# EAGLE design tiny2313_stepper_2 (EAGLE 5.06)
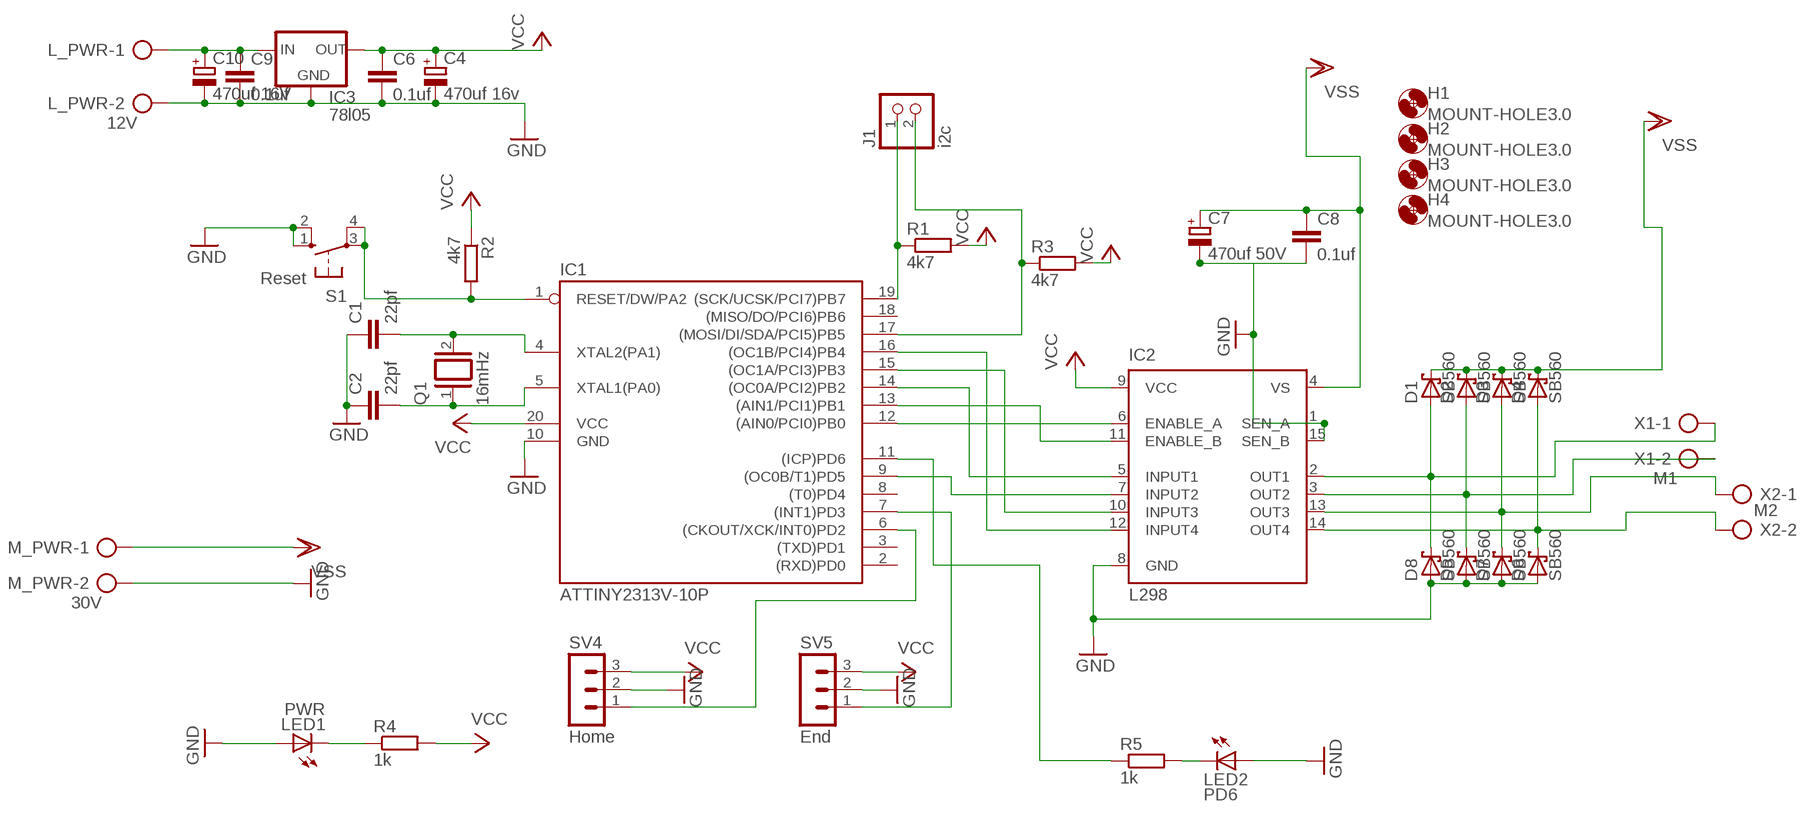
[diagram p0: schematic, sheet 1]

## Parts
C1  22pf  C-EU025-024X044  [C025-024X044]
C2  22pf  C-EU025-024X044  [C025-024X044]
C4  470uf 16v  CPOL-EUE3.5-8  [E3,5-8]
C6  0.1uf  C-EU025-025X050  [C025-025X050]
C7  470uf 50V  CPOL-EUE3.5-8  [E3,5-8]
C8  0.1uf  C-EU025-025X050  [C025-025X050]
C9  0.1uf  C-EU025-025X050  [C025-025X050]
C10  470uf 16V  CPOL-EUE3.5-8  [E3,5-8]
D1  SB560  SCHOTTKY-DIODEF126Z12  [F126Z12]
D2  SB560  SCHOTTKY-DIODEF126Z12  [F126Z12]
D3  SB560  SCHOTTKY-DIODEF126Z12  [F126Z12]
D4  SB560  SCHOTTKY-DIODEF126Z12  [F126Z12]
D5  SB560  SCHOTTKY-DIODEF126Z12  [F126Z12]
D6  SB560  SCHOTTKY-DIODEF126Z12  [F126Z12]
D7  SB560  SCHOTTKY-DIODEF126Z12  [F126Z12]
D8  SB560  SCHOTTKY-DIODEF126Z12  [F126Z12]
H1  MOUNT-HOLE3.0  [3,0]
H2  MOUNT-HOLE3.0  [3,0]
H3  MOUNT-HOLE3.0  [3,0]
H4  MOUNT-HOLE3.0  [3,0]
IC1  ATTINY2313V-10P  [DIL20]
IC2  L298  [MULTIWATT-15]
IC3  78l05  78XXS  [78XXS]
J1  i2c  PINHD-1X2  [1X02]
L_PWR  12V  AK500/2  [AK500/2]
LED1  PWR  LED5MM  [LED5MM]
LED2  PD6  LED5MM  [LED5MM]
M_PWR  30V  AK500/2  [AK500/2]
Q1  16mHz  XTAL/S  [QS]
R1  4k7  R-EU_0204/7  [0204/7]
R2  4k7  R-EU_0204/7  [0204/7]
R3  4k7  R-EU_0204/7  [0204/7]
R4  1k  R-EU_0204/7  [0204/7]
R5  1k  R-EU_0204/7  [0204/7]
S1  Reset  10-XX  [B3F-10XX]
SV4  Home  MA03-1  [MA03-1]
SV5  End  MA03-1  [MA03-1]
X1  M1  AK500/2  [AK500/2]
X2  M2  AK500/2  [AK500/2]

## Nets
GND: C1.1 C2.1 C4.- C6.2 C7.- C8.2 C9.2 C10.- D5.A D6.A D7.A D8.A IC1.10(GND) IC2.1(SEN_A) IC2.8(GND) IC2.15(SEN_B) IC3.GND L_PWR.2 LED1.A LED2.A M_PWR.2 S1.1(S) S1.2(S1) SV4.2 SV5.2
N$1: C1.2 IC1.4(XTAL2(PA1)) Q1.2
N$2: C2.2 IC1.5(XTAL1(PA0)) Q1.1
N$3: IC1.1(RESET/DW/PA2) R2.2 S1.3(P) S1.4(P1)
N$4: IC1.19((SCK/UCSK/PCI7)PB7) J1.1 R1.1
N$5: IC1.17((MOSI/DI/SDA/PCI5)PB5) J1.2 R3.1
N$6: IC1.6((CKOUT/XCK/INT0)PD2) SV4.1
N$7: IC1.12((AIN0/PCI0)PB0) IC2.6(ENABLE_A)
N$8: IC1.13((AIN1/PCI1)PB1) IC2.11(ENABLE_B)
N$9: IC1.14((OC0A/PCI2)PB2) IC2.5(INPUT1)
N$10: IC1.9((OC0B/T1)PD5) IC2.7(INPUT2)
N$11: IC1.15((OC1A/PCI3)PB3) IC2.10(INPUT3)
N$12: IC1.16((OC1B/PCI4)PB4) IC2.12(INPUT4)
N$13: IC1.7((INT1)PD3) SV5.1
N$14: D1.A D8.C IC2.2(OUT1) X1.1
N$15: D2.A D5.C IC2.3(OUT2) X1.2
N$16: D3.A D7.C IC2.13(OUT3) X2.1
N$17: D4.A D6.C IC2.14(OUT4) X2.2
N$19: LED1.K(C) R4.1
N$20: LED2.K(C) R5.2
N$21: C9.1 C10.+ IC3.IN L_PWR.1
N$22: IC1.11((ICP)PD6) R5.1
VCC: C4.+ C6.1 IC1.20(VCC) IC2.9(VCC) IC3.OUT R1.2 R2.1 R3.2 R4.2 SV4.3 SV5.3
VSS: C7.+ C8.1 D1.C D2.C D3.C D4.C IC2.4(VS) M_PWR.1
Unconnected: IC1.2((RXD)PD0) IC1.3((TXD)PD1) IC1.8((T0)PD4) IC1.18((MISO/DO/PCI6)PB6)

## Library data of the parts
C1 C2 = resistor:C-EU: CAPACITOR, European symbol
C4 C7 C10 = rcl:CPOL-EU: POLARIZED CAPACITOR, European symbol
C6 C8 C9 = rcl:C-EU: CAPACITOR, European symbol
D1-D8 = diode:SCHOTTKY-DIODE: Schottky Diode
H1-H4 = holes:MOUNT-HOLE: MOUNTING HOLE with drill center marker
IC1 = avr:ATTINY2313: MICROCONTROLLER 2 Kbytes FLASH 128 bytes SRAM 128 bytes EEPROM USART USI
IC2 = st-microelectronics:L298: DUAL FULL-BRIDGE DRIVER
IC3 = v-reg:78XXS: VOLTAGE REGULATOR
J1 = pinhead:PINHD-1X2: PIN HEADER
L_PWR M_PWR X1 X2 = con-ptr500:AK500/2: CONNECTOR
LED1 LED2 = led:LED: LED OSRAM: - CHIPLED LG R971, LG N971, LY N971, LG Q971, LY Q971, LO R971, LY R971 LH N974, LH R974 LS Q976, LO Q976, LY Q976 LO Q996 - Hyper CHIPLED LW Q18S LB Q993, LB Q99A, LB R99A - SideLED LS A670, LO A670, LY A670, LG A670, LP A670 LB A673, LV A673, LT A673, LW A673 LH A674 LY A675 LS A676, LA A676, LO A676, LY A676, LW A676 LS A679, LY A679, LG A679 - Hyper Micro SIDELED® LS Y876, LA Y876, LO Y876, LY Y876 LT Y87S - SmartLED LW L88C, LW L88S LB L89C, LB L89S, LG L890 LS L89K, LO L89K, LY L89K LS L896, LA L896, LO L896, LY L896 - TOPLED LS T670, LO T670, LY T670, LG T670, LP T670 LSG T670, LSP T670, LSY T670, LOP T670, LYG T670 LG T671, LOG T671, LSG T671 LB T673, LV T673, LT T673, LW T673 LH T674 LS T676, LA T676, LO T676, LY T676, LB T676, LH T676, LSB T676, LW T676 LB T67C, LV T67C, LT T67C, LS T67K, LO T67K, LY T67K, LW E67C LS E67B, LA E67B, LO E67B, LY E67B, LB E67C, LV E67C, LT E67C LW T67C LS T679, LY T679, LG T679 LS T770, LO T770, LY T770, LG T770, LP T770 LB T773, LV T773, LT T773, LW T773 LH T774 LS E675, LA E675, LY E675, LS T675 LS T776, LA T776, LO T776, LY T776, LB T776 LHGB T686 LT T68C, LB T68C - Hyper Mini TOPLED® LB M676 - Mini TOPLED Santana® LG M470 LS M47K, LO M47K, LY M47K Source: http://www.osram.convergy.de LUXEON: - LUMILED® LXK2-PW12-R00, LXK2-PW12-S00, LXK2-PW14-U00, LXK2-PW14-V00 LXK2-PM12-R00, LXK2-PM12-S00, LXK2-PM14-U00 LXK2-PE12-Q00, LXK2-PE12-R00, LXK2-PE12-S00, LXK2-PE14-T00, LXK2-PE14-U00 LXK2-PB12-K00, LXK2-PB12-L00, LXK2-PB12-M00, LXK2-PB14-N00, LXK2-PB14-P00, LXK2-PB14-Q00 LXK2-PR12-L00, LXK2-PR12-M00, LXK2-PR14-Q00, LXK2-PR14-R00 LXK2-PD12-Q00, LXK2-PD12-R00, LXK2-PD12-S00 LXK2-PH12-R00, LXK2-PH12-S00 LXK2-PL12-P00, LXK2-PL12-Q00, LXK2-PL12-R00 Source: www.luxeon.com KINGBRIGHT: KA-3528ASYC Source: www.kingbright.com
Q1 = special:XTAL/S: CRYSTAL
R1 R3 = resistor:R-EU_: RESISTOR, European symbol
R2 R4 R5 = rcl:R-EU_: RESISTOR, European symbol
S1 = switch-omron:10-XX: OMRON SWITCH
SV4 SV5 = con-lstb:MA03-1: PIN HEADER

## Board
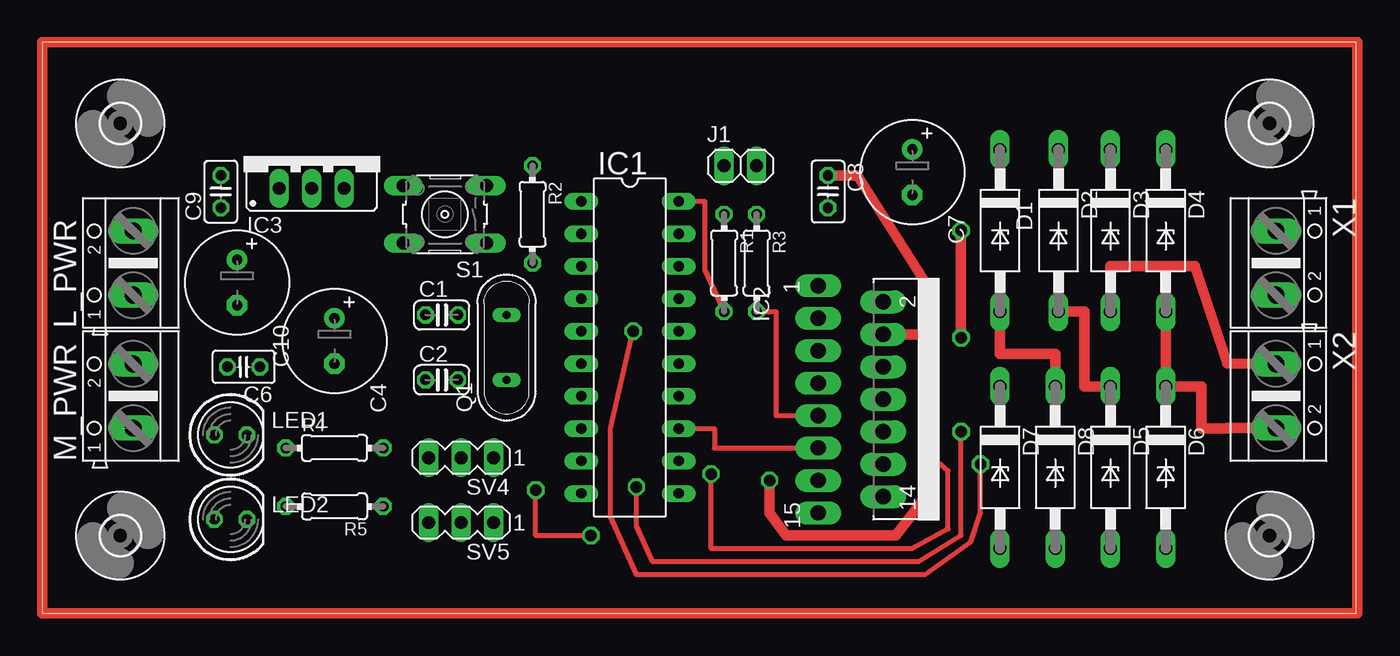
[diagram p1: board, top side]
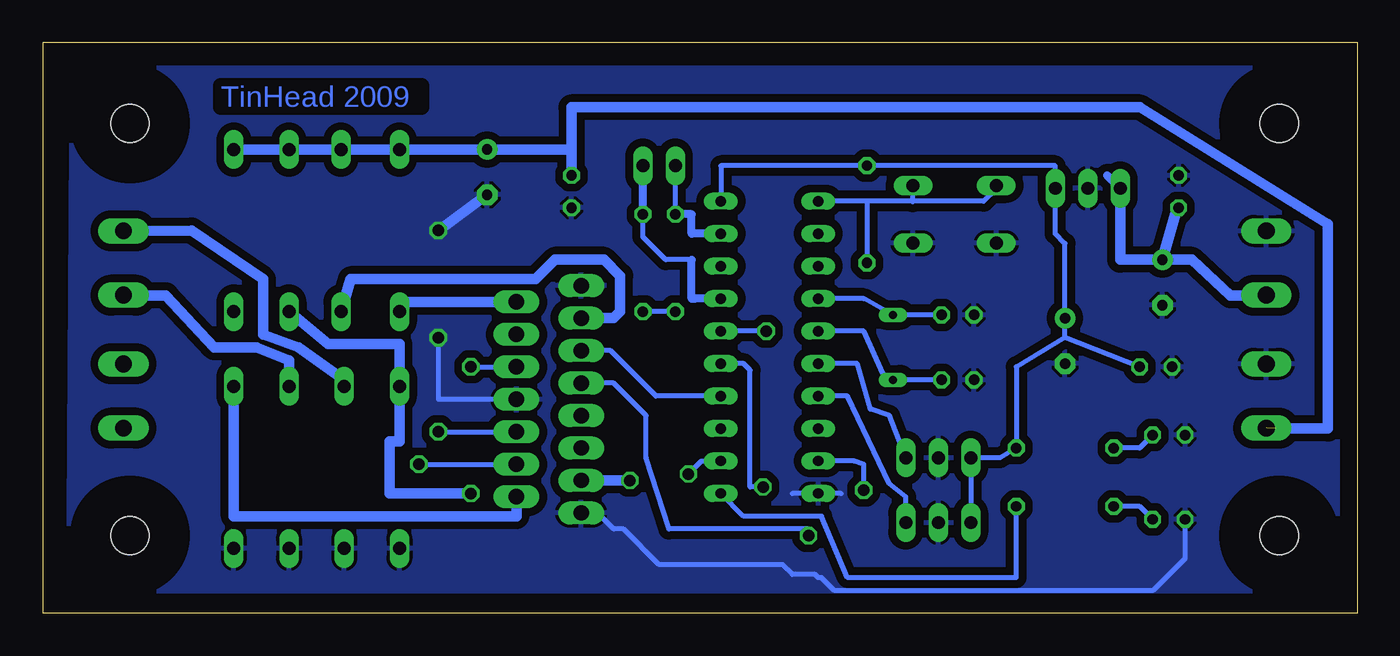
[diagram p2: board, bottom side, seen from below]

Size 102.79 x 44.69 mm. Coordinates in mm from the lower left corner, seen from the top.
Outline: 0,0 102.79,0 102.79,44.69 0,44.69 0,0
Copper layers (1*16): Top 0.035mm / dielectric 1.5mm / Bottom 0.035mm
Design rules "default": minimum track width 10mil, minimum drill 24mil, track to track 8mil, track to pad 8mil, pad to pad 8mil, via to via 8mil, smd to smd 8mil, copper to edge 40mil, drill to drill 8mil, minimum pad ring 10mil, minimum via ring 8mil, stop-mask expansion 4mil, vias tented up to drill 0mil, thermal gap 10mil

### Footprints (pad centres in the part's own frame; a part is rotated, then mirrored left to right if it is on the bottom)
C025-024X044 = drill 0.813 octagon: 1 -1.27,0; 2 1.27,0
E3,5-8 = drill 0.813 pad 1.6 round: + -1.778,0 | drill 0.813 pad 1.6 octagon: - 1.778,0
C025-025X050 = drill 0.813 octagon: 1 -1.27,0; 2 1.27,0
F126Z12 = drill 1.016 long: A 6.35,0; C -6.35,0
3,0 = hole 3: 0,0
DIL20 = drill 0.813 long: 1 -11.43,-3.81; 2 -8.89,-3.81; 3 -6.35,-3.81; 4 -3.81,-3.81; 5 -1.27,-3.81; 6 1.27,-3.81; 7 3.81,-3.81; 8 6.35,-3.81; 9 8.89,-3.81; 10 11.43,-3.81; 11 11.43,3.81; 12 8.89,3.81; 13 6.35,3.81; 14 3.81,3.81; 15 1.27,3.81; 16 -1.27,3.81; 17 -3.81,3.81; 18 -6.35,3.81; 19 -8.89,3.81; 20 -11.43,3.81
MULTIWATT-15 = drill 1.2 long: 1 -8.89,-7.62; 2 -7.62,-2.54; 3 -6.35,-7.62; 4 -5.08,-2.54; 5 -3.81,-7.62; 6 -2.54,-2.54; 7 -1.27,-7.62; 8 0,-2.54; 9 1.27,-7.62; 10 2.54,-2.54; 11 3.81,-7.62; 12 5.08,-2.54; 13 6.35,-7.62; 14 7.62,-2.54; 15 8.89,-7.62
78XXS = drill 1.016 long: GND 0,-2.54; IN -2.54,-2.54; OUT 2.54,-2.54
1X02 = drill 1.016 long: 1 -1.27,0; 2 1.27,0
AK500/2 = drill 1.321 long: 1 -2.515,0; 2 2.515,0
LED5MM = drill 0.813 octagon: A -1.27,0; K 1.27,0
QS = drill 0.61 long: 1 -2.54,0; 2 2.54,0
0204/7 = drill 0.813 octagon: 1 -3.81,0; 2 3.81,0
B3F-10XX = drill 1.016 long: 1 -3.251,2.261; 2 3.251,2.261; 3 -3.251,-2.261; 4 3.251,-2.261
MA03-1 = drill 1.016 long: 1 -2.54,0; 2 0,0; 3 2.54,0

### Placement (x,y rotation side)
C1  31.24,23.37 0 top
C2  31.24,18.29 0 top
C4  22.86,21.34 270 top
C6  15.75,19.3 180 top
C7  68.07,34.54 270 top
C8  61.47,33.02 270 top
C9  13.97,33.02 90 top
C10  15.24,25.91 270 top
D1  74.93,29.97 270 top
D2  79.5,29.97 270 top
D3  83.57,29.97 270 top
D4  87.88,29.97 270 top
D5  83.57,11.43 270 top
D6  87.88,11.43 270 top
D7  74.93,11.43 270 top
D8  79.25,11.43 270 top
H1  96.01,6.1 0 top
H2  96.01,38.35 0 top
H3  6.1,6.1 0 top
H4  6.1,38.35 0 top
IC1  45.97,20.83 270 top
IC2  68.33,16.76 270 top
IC3  21.08,35.81 0 top
J1  54.61,35.05 0 top
L_PWR  7.11,27.43 90 top
LED1  14.73,13.97 0 top
LED2  14.73,7.37 0 top
M_PWR  7.11,17.02 90 top
Q1  36.32,20.83 90 top
R1  53.34,27.43 270 top
R2  38.35,31.24 270 top
R3  55.88,27.43 270 top
R4  22.86,12.95 0 top
R5  22.86,8.38 180 top
S1  31.5,31.24 180 top
SV4  32.77,12.19 180 top
SV5  32.77,7.11 180 top
X1  96.52,27.43 270 top
X2  96.52,17.02 270 top

### Tracks (layer width: path | path; a pad name or v marks a point on that pad's centre or on a via)
GND  (via drill 0.9 pad 1.27)
  Top 0.813: v71.88,21.59 v71.88,29.97
  Bottom 0.406: IC2.8 71.88,16.76 v71.88,21.59 | 40.39,9.4 IC1.10 44.2,9.4 | IC2.15 59.44,7.87 58.17,6.6 57.4,6.6 54.61,3.81 44.96,3.81 44.2,3.05 42.42,3.05 42.16,2.79 41.91,2.79 40.89,1.78 16,1.78 13.46,4.32 LED2.A
  Bottom 0.813: v71.88,29.97 C7.-
  pour Bottom (isolate 0.61): 1.52,42.67 100.58,42.67 100.84,1.78 1.52,1.78
N$1
  Bottom 0.406: C1.2 Q1.2 38.61,24.64 IC1.4
N$2
  Bottom 0.406: C2.2 Q1.1 37.08,18.8 38.61,22.1 IC1.5
N$3
  Bottom 0.406: 38.35,32.26 R2.2 | 38.35,32.26 IC1.1 | 34.77,32.23 S1.3 | 34.77,32.23 34.8,32.26 38.35,32.26 | S1.4 28.25,33.22 29.21,32.26 34.75,32.26 34.77,32.23
N$4
  Bottom 0.406: R1.1 J1.1
  Bottom 0.61: IC1.19 52.07,29.72 52.07,31.24 R1.1
N$5
  Bottom 0.406: 51.82,24.64 52.07,24.64 | 52.07,27.69 54.1,27.69 55.88,29.46 R3.1
  Bottom 0.61: R3.1 J1.2 | 52.07,24.64 52.07,27.69 | IC1.17 51.82,24.64
N$6
  Bottom 0.406: SV4.1 36.58,15.49 38.1,16 39.12,19.56 IC1.6
N$7  (via drill 0.9 pad 1.27)
  Top 0.406: v52.32,10.92 52.32,5.08 68.07,5.08 70.87,6.6 70.87,11.18 69.34,12.45 v69.34,19.3
  Bottom 0.406: IC1.12 51.31,11.94 v52.32,10.92 | v69.34,19.3 IC2.6
N$8
  Top 0.406: IC1.13 52.58,14.48 52.58,12.95 IC2.11
N$9
  Bottom 0.406: IC1.14 54.86,17.02 58.42,20.57 IC2.5
N$10  (via drill 0.9 pad 1.27)
  Top 0.406: v42.93,6.1 38.61,6.1 v38.61,9.65
  Bottom 0.406: IC1.9 39.37,11.94 38.61,11.68 v38.61,9.65 | IC2.7 58.17,18.03 55.63,15.49 55.63,12.19 53.85,6.6 42.93,6.6 v42.93,6.1
N$11  (via drill 0.9 pad 1.27)
  Top 0.406: v46.48,9.91 46.48,6.86 47.75,4.06 68.58,4.06 71.88,6.1 v71.88,14.22
  Bottom 0.406: IC1.15 48.01,19.56 47.5,19.05 47.5,9.91 v46.48,9.91 | v71.88,14.22 IC2.10
N$12  (via drill 0.9 pad 1.27)
  Top 0.406: v73.41,11.68 73.41,7.87 72.64,5.59 69.09,3.05 46.48,3.05 44.45,7.62 44.45,14.48 v46.23,22.1
  Bottom 0.406: v73.41,11.68 IC2.12 | v46.23,22.1 IC1.16
N$13
  Bottom 0.406: SV5.1 35.31,9.14 36.58,10.16 39.88,17.02 IC1.7
N$14
  Top 0.813: D1.A 74.93,21.34 74.93,20.32 79.25,20.32 D8.C
  Bottom 0.813: IC2.2 74.68,24.38 D1.A | D8.C 79.25,18.29 82.8,20.83 85.6,21.84 85.6,26.16 91.19,29.97 X1.1
N$15
  Top 0.813: D2.A 81.53,23.62 81.53,17.78 D5.C
  Bottom 0.813: 61.21,23.11 IC2.3 58.17,23.11 57.66,23.62 57.66,26.42 58.93,27.69 62.74,27.69 64.26,26.16 78.74,26.16 D2.A | D5.C 83.57,19.81 86.11,20.83 89.41,20.83 93.22,24.89 96.24,24.89 X1.2
N$16  (via drill 0.9 pad 1.27)
  Top 0.813: v56.9,10.41 56.9,7.87 58.17,6.1 66.8,6.1 v69.34,9.4 | D3.A 83.57,27.18 90.17,27.18 92.71,19.56 X2.1
  Bottom 0.813: v69.34,9.4 75.69,9.4 75.69,13.46 74.93,13.46 D7.C 74.93,21.08 80.52,21.08 D3.A | v56.9,10.41 IC2.13
N$17
  Top 0.813: D4.A D6.C 90.68,17.78 90.68,14.48 92.71,14.48 92.71,14.5 X2.2
  Bottom 0.813: IC2.14 65.79,7.62 87.88,7.62 D6.C
N$18
  Top 0.813: 0,44.7 102.87,44.7 | 102.87,0 102.87,44.7 | 0,0 102.87,0 | 0,0 0,44.7 | 0,44.7 102.87,44.7 | 0,0 0,44.7 | 0,0 102.87,0 | 102.87,0 102.87,44.7
N$19
  Bottom 0.406: R4.1 17.02,12.95 LED1.K
N$20
  Bottom 0.406: LED2.K 17.02,8.38 R5.2
N$21
  Bottom 0.406: L_PWR.1 7.14,24.89
  Bottom 0.61: 14.22,31.24 C9.1 | IC3.IN 19.56,34.29
  Bottom 0.813: C10.+ 12.95,27.69 9.91,24.89 7.14,24.89 | C10.+ 14.22,31.24 | C10.+ 18.54,27.69 IC3.IN
N$22
  Bottom 0.406: R5.1 26.67,2.79 39.88,2.79 41.91,7.62 48.01,7.62 IC1.11
VCC
  Top 0.406: IC2.9 57.4,15.49 57.4,23.62 R3.2 | IC1.20 51.82,32.26 51.82,26.92 R1.2
  Bottom 0.406: 22.86,23.62 C4.+ | 22.86,23.62 22.86,28.96 23.62,29.72 IC3.OUT 23.62,35.05 R2.1 49.78,35.05 IC1.20 | 22.86,21.59 26.67,19.3 R4.2 27.94,12.19 SV4.3 SV5.3 | C6.1 22.86,21.59 | 22.86,21.59 22.86,23.62 | R1.2 R3.2
VSS  (1 unrouted)
  Top 0.406: 69.09,22.1 68.83,21.84
  Top 0.813: C8.1 63.75,34.29 69.09,25.91 69.09,22.1 | 68.83,21.84 IC2.4
  Bottom 0.813: 6.35,14.48 2.29,14.48 2.29,30.48 17.02,39.62 61.47,39.62 61.47,36.32 | 61.47,36.32 C8.1 | 61.47,36.32 C7.+ D1.C D2.C D3.C D4.C

### Text on the board
Bottom: TinHead 2009